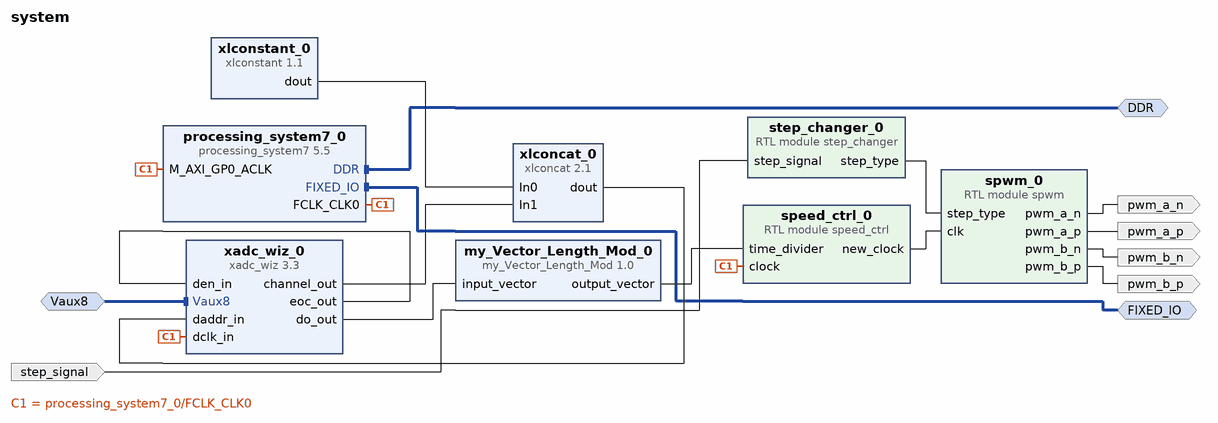
[diagram p0: block diagram of the top level]
# Vivado block design system, xc7z010clg400-1, Vivado 2018.2
create_bd_design system

create_bd_intf_port -mode Slave -vlnv xilinx.com:interface:diff_analog_io_rtl:1.0 Vaux8
create_bd_intf_port -mode Master -vlnv xilinx.com:interface:ddrx_rtl:1.0 DDR
create_bd_intf_port -mode Master -vlnv xilinx.com:display_processing_system7:fixedio_rtl:1.0 FIXED_IO
create_bd_port -dir I step_signal
create_bd_port -dir O pwm_a_p
create_bd_port -dir O pwm_a_n
create_bd_port -dir O pwm_b_p
create_bd_port -dir O pwm_b_n

create_bd_cell -type ip -vlnv xilinx.com:ip:processing_system7:5.5 processing_system7_0
# 1 more settings of processing_system7_0 are not shown: defaults, MIO pin electricals, DDR timing, and values the tool derives
create_bd_cell -type ip -vlnv xilinx.com:ip:xadc_wiz:3.3 xadc_wiz_0
set_property -dict [list \
  CONFIG.INTERFACE_SELECTION ENABLE_DRP \
  CONFIG.ENABLE_RESET true \
  CONFIG.OT_ALARM false \
  CONFIG.USER_TEMP_ALARM false \
  CONFIG.VCCINT_ALARM false \
  CONFIG.VCCAUX_ALARM false \
  CONFIG.ENABLE_VCCPINT_ALARM false \
  CONFIG.ENABLE_VCCPAUX_ALARM false \
  CONFIG.ENABLE_VCCDDRO_ALARM false \
  CONFIG.SINGLE_CHANNEL_SELECTION VAUXP8_VAUXN8 \
] [get_bd_cells xadc_wiz_0]
create_bd_cell -type ip -vlnv xilinx.com:ip:xlconstant:1.1 xlconstant_0
set_property -dict {CONFIG.CONST_WIDTH 2} [get_bd_cells xlconstant_0]
create_bd_cell -type ip -vlnv xilinx.com:ip:xlconcat:2.1 xlconcat_0
set_property -dict {CONFIG.NUM_PORTS 2 CONFIG.IN0_WIDTH 2 CONFIG.IN1_WIDTH 5} [get_bd_cells xlconcat_0]
create_bd_cell -type ip -vlnv xilinx.com:user:my_Vector_Length_Mod:1.0 my_Vector_Length_Mod_0
create_bd_cell -type module -reference spwm spwm_0
create_bd_cell -type module -reference speed_ctrl speed_ctrl_0
create_bd_cell -type module -reference step_changer step_changer_0

# ---- connections ----

connect_bd_intf_net -intf_net Vaux8_0_1 [get_bd_intf_ports Vaux8] [get_bd_intf_pins xadc_wiz_0/Vaux8]
connect_bd_intf_net [get_bd_intf_ports DDR] [get_bd_intf_pins processing_system7_0/DDR]
connect_bd_intf_net [get_bd_intf_ports FIXED_IO] [get_bd_intf_pins processing_system7_0/FIXED_IO]
connect_bd_net [get_bd_pins xadc_wiz_0/eoc_out] [get_bd_pins xadc_wiz_0/den_in]
connect_bd_net [get_bd_pins xadc_wiz_0/channel_out] [get_bd_pins xlconcat_0/In1]
connect_bd_net [get_bd_pins xlconstant_0/dout] [get_bd_pins xlconcat_0/In0]
connect_bd_net [get_bd_pins xlconcat_0/dout] [get_bd_pins xadc_wiz_0/daddr_in]
connect_bd_net [get_bd_pins processing_system7_0/FCLK_CLK0] \
  [get_bd_pins xadc_wiz_0/dclk_in] [get_bd_pins processing_system7_0/M_AXI_GP0_ACLK] [get_bd_pins speed_ctrl_0/clock]
connect_bd_net [get_bd_pins speed_ctrl_0/new_clock] [get_bd_pins spwm_0/clk]
connect_bd_net [get_bd_pins xadc_wiz_0/do_out] [get_bd_pins my_Vector_Length_Mod_0/input_vector]
connect_bd_net [get_bd_pins my_Vector_Length_Mod_0/output_vector] [get_bd_pins speed_ctrl_0/time_divider]
connect_bd_net [get_bd_pins step_changer_0/step_type] [get_bd_pins spwm_0/step_type]
connect_bd_net -net step_signal_0_1 [get_bd_ports step_signal] [get_bd_pins step_changer_0/step_signal]
connect_bd_net [get_bd_pins spwm_0/pwm_a_p] [get_bd_ports pwm_a_p]
connect_bd_net [get_bd_pins spwm_0/pwm_a_n] [get_bd_ports pwm_a_n]
connect_bd_net [get_bd_pins spwm_0/pwm_b_p] [get_bd_ports pwm_b_p]
connect_bd_net [get_bd_pins spwm_0/pwm_b_n] [get_bd_ports pwm_b_n]

validate_bd_design
save_bd_design
